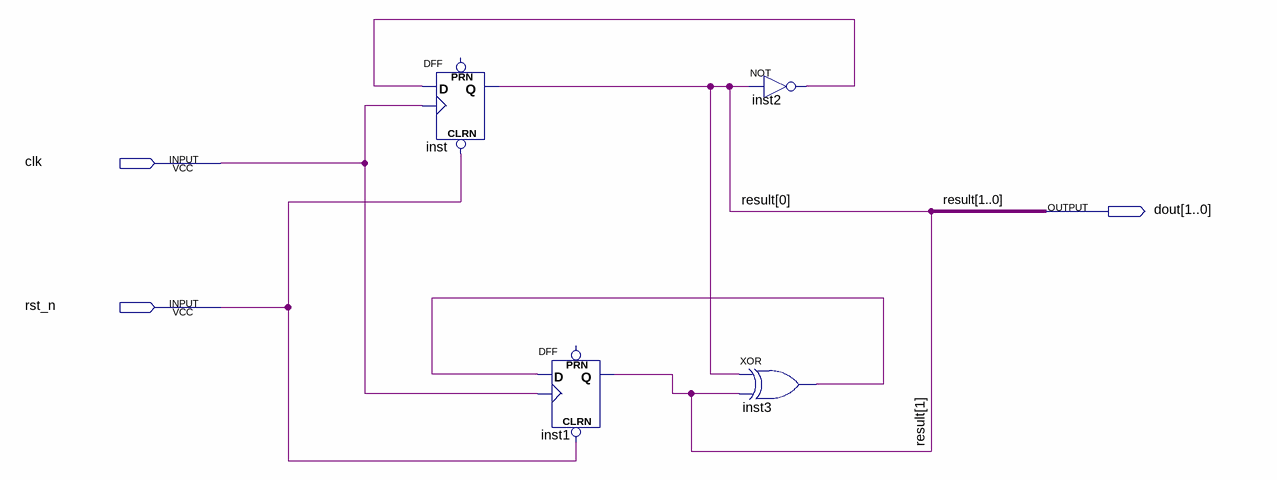
[diagram p0: schematic sheet]
// Quartus schematic counter4.bdf as structural Verilog: 4 symbols, 3 pins
module counter4 (
  input  clk,
  input  rst_n,
  output [1:0] dout
);

  wire inst2_out, inst3_out;

  DFF inst (.CLRN(rst_n), .CLK(clk), .D(inst2_out), .Q(dout[0]));  // open: PRN
  DFF inst1 (.CLRN(rst_n), .CLK(clk), .D(inst3_out), .Q(dout[1]));  // open: PRN
  not inst2 (inst2_out, dout[0]);
  xor inst3 (inst3_out, dout[0], dout[1]);

  // Other names for the same wires on the sheet: result[1:0] = dout
endmodule
